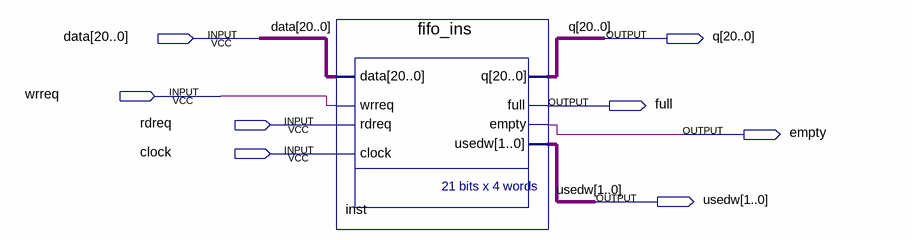
[diagram p0: schematic sheet]
// Quartus schematic FIFO_Module.bdf as structural Verilog: 1 symbols, 8 pins
module FIFO_Module (
  input  [20:0] data,
  input  wrreq,
  input  rdreq,
  input  clock,
  output [20:0] q,
  output full,
  output empty,
  output [1:0] usedw
);

  fifo_ins inst (
    .data(data), .wrreq(wrreq), .rdreq(rdreq), .clock(clock), .q(q), .full(full), .empty(empty), .usedw(usedw));
endmodule
